# Altium project STM32_board_4layers.PrjPCB
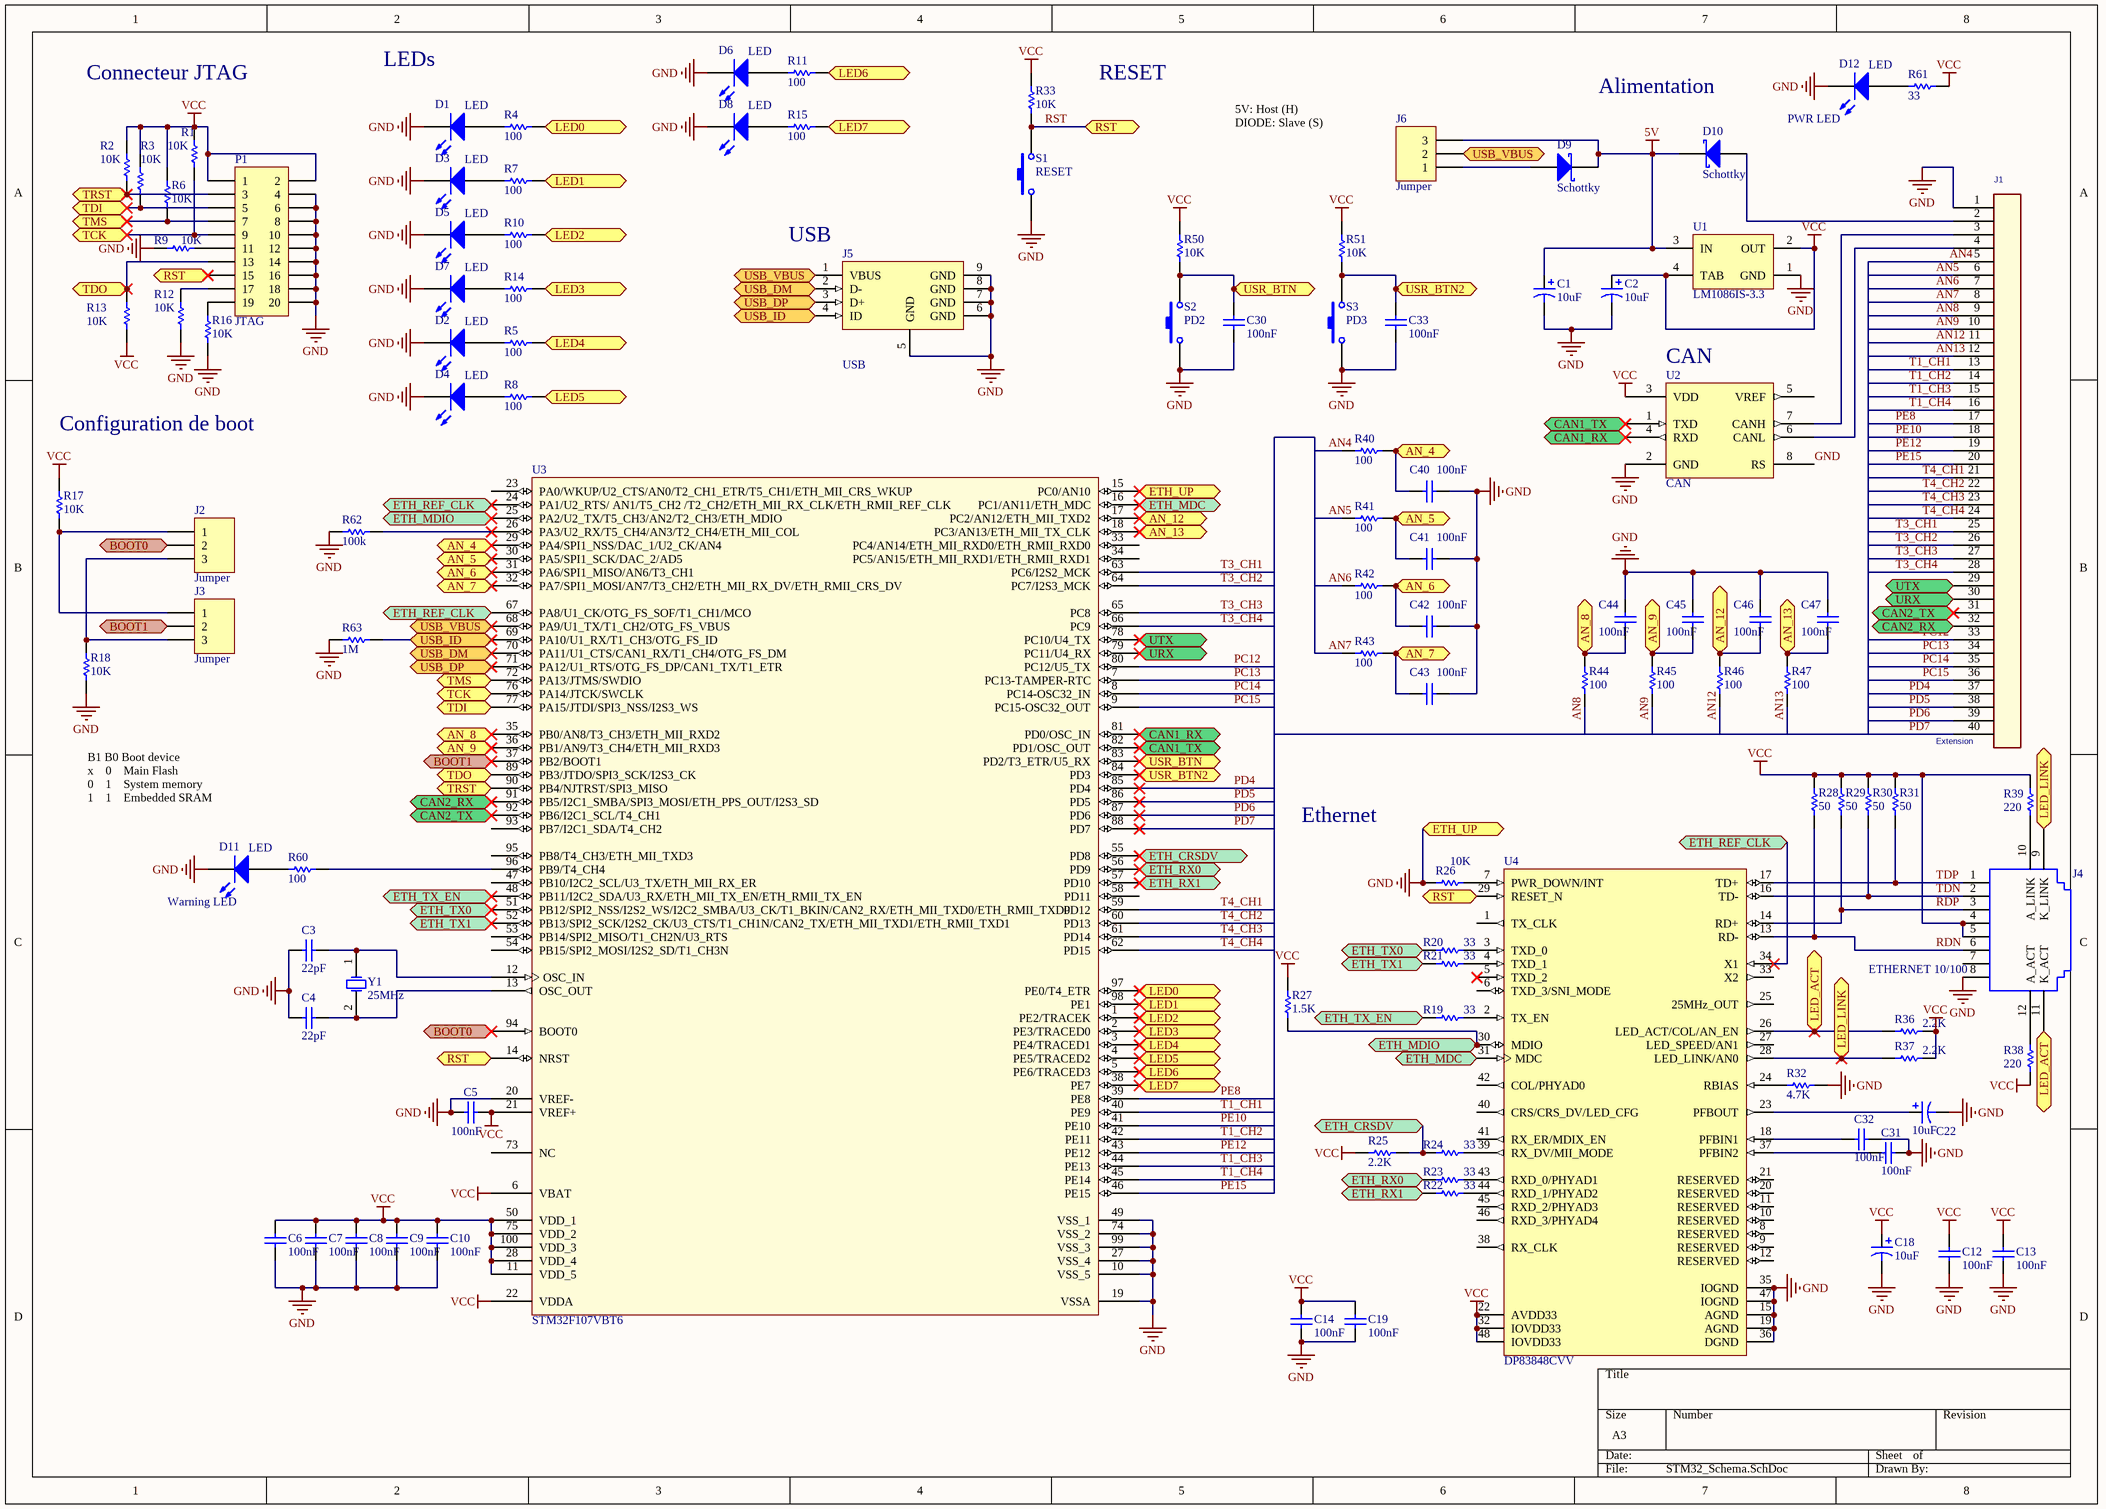
[diagram p0: STM32_Schema.SchDoc]
1 sheet, 106 parts. Net scope: flat (ports and power ports of the same name join across sheets).
Board file: STM32_PCB.PcbDoc

## Sheet STM32_Schema.SchDoc
size A3

### Parts
C1  10uF  [TC7343-2917]
C2  10uF  [TC7343-2917]
C3  22pF  [COND_CMS_0805]
C4  22pF  [COND_CMS_0805]
C5  100nF  [COND_CMS_0805]
C6  100nF  [COND_CMS_0805]
C7  100nF  [COND_CMS_0805]
C8  100nF  [COND_CMS_0805]
C9  100nF  [COND_CMS_0805]
C10  100nF  [COND_CMS_0805]
C12  100nF  [COND_CMS_0805]
C13  100nF  [COND_CMS_0805]
C14  100nF  [COND_CMS_0805]
C18  10uF  [TC7343-2917]
C19  100nF  [COND_CMS_0805]
C22  10uF  [TC7343-2917]
C30  100nF  [COND_CMS_0805]
C31  100nF  [COND_CMS_0805]
C32  100nF  [COND_CMS_0805]
C33  100nF  [COND_CMS_0805]
C40  100nF  [COND_CMS_0805]
C41  100nF  [COND_CMS_0805]
C42  100nF  [COND_CMS_0805]
C43  100nF  [COND_CMS_0805]
C44  100nF  [COND_CMS_0805]
C45  100nF  [COND_CMS_0805]
C46  100nF  [COND_CMS_0805]
C47  100nF  [COND_CMS_0805]
D1  LED  [LED_1206]
D2  LED  [LED_1206]
D3  LED  [LED_1206]
D4  LED  [LED_1206]
D5  LED  [LED_1206]
D6  LED  [LED_1206]
D7  LED  [LED_1206]
D8  LED  [LED_1206]
D9  Schottky  [DIODE_SMB]
D10  Schottky  [DIODE_SMB]
D11  LED  [LED_1206]
D12  LED  [LED_1206]
J1  Extension  [HE10/40_FACTO]
J2  Jumper  [HEADER3]
J3  Jumper  [HEADER3]
J4  ETHERNET 10/100  [RJ45_8/8 W/ LEDS]
J5  USB  [MINI_USB_B]
J6  Jumper  [HEADER3]
P1  JTAG  [HE10-JTAG-STM]
R1  10K  [RES_CMS_1206]
R2  10K  [RES_CMS_1206]
R3  10K  [RES_CMS_1206]
R4  100  [RES_CMS_1206]
R5  100  [RES_CMS_1206]
R6  10K  [RES_CMS_1206]
R7  100  [RES_CMS_1206]
R8  100  [RES_CMS_1206]
R9  10K  [RES_CMS_1206]
R10  100  [RES_CMS_1206]
R11  100  [RES_CMS_1206]
R12  10K  [RES_CMS_1206]
R13  10K  [RES_CMS_1206]
R14  100  [RES_CMS_1206]
R15  100  [RES_CMS_1206]
R16  10K  [RES_CMS_1206]
R17  10K  [RES_CMS_1206]
R18  10K  [RES_CMS_1206]
R19  33  [RES_CMS_1206]
R20  33  [RES_CMS_1206]
R21  33  [RES_CMS_1206]
R22  33  [RES_CMS_1206]
R23  33  [RES_CMS_1206]
R24  33  [RES_CMS_1206]
R25  2.2K  [RES_CMS_1206]
R26  10K  [RES_CMS_1206]
R27  1.5K  [RES_CMS_1206]
R28  50  [RES_CMS_1206]
R29  50  [RES_CMS_1206]
R30  50  [RES_CMS_1206]
R31  50  [RES_CMS_1206]
R32  4.7K  [RES_CMS_1206]
R33  10K  [RES_CMS_1206]
R36  2.2K  [RES_CMS_1206]
R37  2.2K  [RES_CMS_1206]
R38  220  [RES_CMS_1206]
R39  220  [RES_CMS_1206]
R40  100  [RES_CMS_1206]
R41  100  [RES_CMS_1206]
R42  100  [RES_CMS_1206]
R43  100  [RES_CMS_1206]
R44  100  [RES_CMS_1206]
R45  100  [RES_CMS_1206]
R46  100  [RES_CMS_1206]
R47  100  [RES_CMS_1206]
R50  10K  [RES_CMS_1206]
R51  10K  [RES_CMS_1206]
R60  100  [RES_CMS_1206]
R61  33  [RES_CMS_1206]
R62  100k  [RES_CMS_1206]
R63  1M  [RES_CMS_1206]
S1  RESET  [TOUCHE_KSA]
S2  PD2  [TOUCHE_KSA]
S3  PD3  [TOUCHE_KSA]
U1  LM1086IS-3.3  [TO-263]
U2  CAN  [SOIC8]
U3  STM32F107VBT6  [LQFP100_N]
U4  DP83848CVV  [LQFP48]
Y1  25MHz  [QUARTZ_CMS]

### Ports
AN_4, AN_5, AN_6, AN_7, AN_8, AN_9, AN_12, AN_13, BOOT0, BOOT1, CAN1_RX, CAN1_TX, CAN2_RX, CAN2_TX, ETH_CRSDV, ETH_MDC, ETH_MDIO, ETH_REF_CLK, ETH_RX0, ETH_RX1, ETH_TX0, ETH_TX1, ETH_TX_EN, ETH_UP, LED0, LED1, LED2, LED3, LED4, LED5, LED6, LED7, LED_ACT, LED_LINK, RST, TCK, TDI, TDO, TMS, TRST, URX, USB_DM, USB_DP, USB_ID, USB_VBUS, USR_BTN, USR_BTN2, UTX

### Nets
5V: C1.1 D9.1(K) D10.1(K) J6.3 U1.3(IN)
GND: C1.2 C2.2 C3.1 C4.1 C5.1 C6.1 C7.1 C8.1 C9.1 C10.1 C12.1 C13.1 C14.1 C18.2 C19.1 C22.2 C30.1 C31.1 C32.1 C33.1 C40.1 C41.1 C42.1 C43.1 C44.1 C45.1 C46.1 C47.1 D1.2 D2.2 D3.2 D4.2 D5.2 D6.2 D7.2 D8.2 D11.2 D12.2 J1.1 J4.8(GND) J5.5(GND) J5.6(GND) J5.7(GND) J5.8(GND) J5.9(GND) P1.4 P1.6 P1.8 P1.10 P1.12 P1.14 P1.16 P1.18 P1.20 R9.2 R12.1 R16.1 R18.2 R26.2 R32.1 R62.1 R63.1 S1.1 S2.1 S3.1 U1.1(GND) U2.2(GND) U2.8(RS) U3.10(VSS_5) U3.15(PC0/AN10) U3.19(VSSA) U3.20(VREF-) U3.27(VSS_4) U3.49(VSS_1) U3.74(VSS_2) U3.99(VSS_3) U4.15(AGND) U4.19(AGND) U4.35(IOGND) U4.36(DGND) U4.47(IOGND) ; port ETH_UP
VCC: C2.1 C5.2 C6.2 C7.2 C8.2 C9.2 C10.2 C12.2 C13.2 C14.2 C18.1 C19.2 J4.4(RD+) J4.5(RCT) P1.1 P1.2 R1.2 R2.2 R3.2 R6.2 R13.1 R17.1 R25.2 R27.2 R28.2 R29.2 R30.1 R31.2 R33.1 R36.1 R37.1 R38.2 R39.1 R50.1 R51.1 R61.2 U1.2(OUT) U1.4(TAB) U2.3(VDD) U3.6(VBAT) U3.11(VDD_5) U3.21(VREF+) U3.22(VDDA) U3.28(VDD_4) U3.50(VDD_1) U3.75(VDD_2) U3.100(VDD_3) U4.22(AVDD33) U4.32(IOVDD33) U4.48(IOVDD33)
AN4: J1.5 R40.1
AN5: J1.6 R41.1
AN6: J1.7 R42.1
AN7: J1.8 R43.1
AN8: J1.9 R44.1
AN9: J1.10 R45.1
AN12: J1.11 R46.1
AN13: J1.12 R47.1
PC12: J1.33 U3.80(PC12/U5_TX)
PC13: J1.34 U3.7(PC13-TAMPER-RTC)
PC14: J1.35 U3.8(PC14-OSC32_IN)
PC15: J1.36 U3.9(PC15-OSC32_OUT)
PD4: J1.37 U3.85(PD4)
PD5: J1.38 U3.86(PD5)
PD6: J1.39 U3.87(PD6)
PD7: J1.40 U3.88(PD7)
PE8: J1.17 U3.39(PE8)
PE10: J1.18 U3.41(PE10)
PE12: J1.19 U3.43(PE12)
PE15: J1.20 U3.46(PE15)
RDN: J4.6(RD-) R28.1 U4.13(RD-)
RDP: J4.3(TD-) R29.1 U4.14(RD+)
RST: P1.15 R33.2 S1.2 U3.14(NRST) U4.29(RESET_N) ; port RST
T1_CH1: J1.13 U3.40(PE9)
T1_CH2: J1.14 U3.42(PE11)
T1_CH3: J1.15 U3.44(PE13)
T1_CH4: J1.16 U3.45(PE14)
T3_CH1: J1.25 U3.63(PC6/I2S2_MCK)
T3_CH2: J1.26 U3.64(PC7/I2S3_MCK)
T3_CH3: J1.27 U3.65(PC8)
T3_CH4: J1.28 U3.66(PC9)
T4_CH1: J1.21 U3.59(PD12)
T4_CH2: J1.22 U3.60(PD13)
T4_CH3: J1.23 U3.61(PD14)
T4_CH4: J1.24 U3.62(PD15)
TDN: J4.2(TCT) R30.2 U4.16(TD-)
TDP: J4.1(TD+) R31.1 U4.17(TD+)
NetC3_2: C3.2 U3.12(OSC_IN) Y1.1(OSC1)
NetC4_2: C4.2 U3.13(OSC_OUT) Y1.2(OSC2)
NetC22_1: C22.1 U4.23(PFBOUT)
NetC30_2: C30.2 R50.2 S2.2 U3.83(PD2/T3_ETR/U5_RX) ; port USR_BTN
NetC31_2: C31.2 U4.37(PFBIN2)
NetC32_2: C32.2 U4.18(PFBIN1)
NetC33_2: C33.2 R51.2 S3.2 U3.84(PD3) ; port USR_BTN2
NetC40_2: C40.2 R40.2 U3.29(PA4/SPI1_NSS/DAC_1/U2_CK/AN4) ; port AN_4
NetC41_2: C41.2 R41.2 U3.30(PA5/SPI1_SCK/DAC_2/AD5) ; port AN_5
NetC42_2: C42.2 R42.2 U3.31(PA6/SPI1_MISO/AN6/T3_CH1) ; port AN_6
NetC43_2: C43.2 R43.2 U3.32(PA7/SPI1_MOSI/AN7/T3_CH2/ETH_MII_RX_DV/ETH_RMII_CRS_DV) ; port AN_7
NetC44_2: C44.2 R44.2 U3.35(PB0/AN8/T3_CH3/ETH_MII_RXD2) ; port AN_8
NetC45_2: C45.2 R45.2 U3.36(PB1/AN9/T3_CH4/ETH_MII_RXD3) ; port AN_9
NetC46_2: C46.2 R46.2 U3.17(PC2/AN12/ETH_MII_TXD2) ; port AN_12
NetC47_2: C47.2 R47.2 U3.18(PC3/AN13/ETH_MII_TX_CLK) ; port AN_13
NetD1_1: D1.1 R4.1
NetD2_1: D2.1 R5.1
NetD3_1: D3.1 R7.1
NetD4_1: D4.1 R8.1
NetD5_1: D5.1 R10.1
NetD6_1: D6.1 R11.1
NetD7_1: D7.1 R14.1
NetD8_1: D8.1 R15.1
NetD9_2: D9.2(A) J6.1
NetD10_2: D10.2(A) J1.2
NetD11_1: D11.1 R60.1
NetD12_1: D12.1 R61.1
NetJ1_3: J1.3 U2.7(CANH)
NetJ1_4: J1.4 U2.6(CANL)
NetJ1_29: J1.29 U3.78(PC10/U4_TX) ; port UTX
NetJ1_30: J1.30 U3.79(PC11/U4_RX) ; port URX
NetJ1_31: J1.31 U3.92(PB6/I2C1_SCL/T4_CH1) ; port CAN2_TX
NetJ1_32: J1.32 U3.91(PB5/I2C1_SMBA/SPI3_MOSI/ETH_PPS_OUT/I2S3_SD) ; port CAN2_RX
NetJ2_1: J2.1 J3.1 R17.2
NetJ2_2: J2.2 U3.94(BOOT0) ; port BOOT0
NetJ2_3: J2.3 J3.3 R18.1
NetJ3_2: J3.2 U3.37(PB2/BOOT1) ; port BOOT1
NetJ4_9: J4.9(K_LINK) R37.2 U4.28(LED_LINK/AN0) ; port LED_LINK
NetJ4_10: J4.10(A_LINK) R39.2
NetJ4_11: J4.11(K_ACT) R36.2 U4.26(LED_ACT/COL/AN_EN) ; port LED_ACT
NetJ4_12: J4.12(A_ACT) R38.1
NetJ5_1: J5.1(VBUS) J6.2 U3.68(PA9/U1_TX/T1_CH2/OTG_FS_VBUS) ; port USB_VBUS
NetJ5_2: J5.2(D-) U3.70(PA11/U1_CTS/CAN1_RX/T1_CH4/OTG_FS_DM) ; port USB_DM
NetJ5_3: J5.3(D+) U3.71(PA12/U1_RTS/OTG_FS_DP/CAN1_TX/T1_ETR) ; port USB_DP
NetJ5_4: J5.4(ID) R63.2 U3.69(PA10/U1_RX/T1_CH3/OTG_FS_ID) ; port USB_ID
NetP1_3: P1.3 R2.1 U3.90(PB4/NJTRST/SPI3_MISO) ; port TRST
NetP1_5: P1.5 R3.1 U3.77(PA15/JTDI/SPI3_NSS/I2S3_WS) ; port TDI
NetP1_7: P1.7 R6.1 U3.72(PA13/JTMS/SWDIO) ; port TMS
NetP1_9: P1.9 R1.1 U3.76(PA14/JTCK/SWCLK) ; port TCK
NetP1_11: P1.11 R9.1
NetP1_13: P1.13 R13.2 U3.89(PB3/JTDO/SPI3_SCK/I2S3_CK) ; port TDO
NetP1_17: P1.17 R12.2
NetP1_19: P1.19 R16.2
NetR4_2: R4.2 U3.97(PE0/T4_ETR) ; port LED0
NetR5_2: R5.2 U3.3(PE4/TRACED1) ; port LED4
NetR7_2: R7.2 U3.98(PE1) ; port LED1
NetR8_2: R8.2 U3.4(PE5/TRACED2) ; port LED5
NetR10_2: R10.2 U3.1(PE2/TRACEK) ; port LED2
NetR11_2: R11.2 U3.5(PE6/TRACED3) ; port LED6
NetR14_2: R14.2 U3.2(PE3/TRACED0) ; port LED3
NetR15_2: R15.2 U3.38(PE7) ; port LED7
NetR19_1: R19.1 U3.48(PB11/I2C2_SDA/U3_RX/ETH_MII_TX_EN/ETH_RMII_TX_EN) ; port ETH_TX_EN
NetR19_2: R19.2 U4.2(TX_EN)
NetR20_1: R20.1 U3.51(PB12/SPI2_NSS/I2S2_WS/I2C2_SMBA/U3_CK/T1_BKIN/CAN2_RX/ETH_MII_TXD0/ETH_RMII_TXD0) ; port ETH_TX0
NetR20_2: R20.2 U4.3(TXD_0)
NetR21_1: R21.1 U3.52(PB13/SPI2_SCK/I2S2_CK/U3_CTS/T1_CH1N/CAN2_TX/ETH_MII_TXD1/ETH_RMII_TXD1) ; port ETH_TX1
NetR21_2: R21.2 U4.4(TXD_1)
NetR22_1: R22.1 U3.57(PD10) ; port ETH_RX1
NetR22_2: R22.2 U4.44(RXD_1/PHYAD2)
NetR23_1: R23.1 U3.56(PD9) ; port ETH_RX0
NetR23_2: R23.2 U4.43(RXD_0/PHYAD1)
NetR24_1: R24.1 R25.1 U3.55(PD8) ; port ETH_CRSDV
NetR24_2: R24.2 U4.39(RX_DV/MII_MODE)
NetR26_1: R26.1 U4.7(PWR_DOWN/INT)
NetR27_1: R27.1 U3.25(PA2/U2_TX/T5_CH3/AN2/T2_CH3/ETH_MDIO) U4.30(MDIO) ; port ETH_MDIO
NetR32_2: R32.2 U4.24(RBIAS)
NetR60_2: R60.2 U3.96(PB9/T4_CH4)
NetR62_2: R62.2 U3.26(PA3/U2_RX/T5_CH4/AN3/T2_CH4/ETH_MII_COL)
NetU2_1: U2.1(TXD) U3.82(PD1/OSC_OUT) ; port CAN1_TX
NetU2_4: U2.4(RXD) U3.81(PD0/OSC_IN) ; port CAN1_RX
NetU3_16: U3.16(PC1/AN11/ETH_MDC) U4.31(MDC) ; port ETH_MDC
NetU3_24: U3.24(PA1/U2_RTS/_AN1/T5_CH2_/T2_CH2/ETH_MII_RX_CLK/ETH_RMII_REF_CLK) U3.67(PA8/U1_CK/OTG_FS_SOF/T1_CH1/MCO) U4.34(X1) ; port ETH_REF_CLK

Not connected (* = marked no-connect by the designer): J4 7; U2 5(VREF); U3 23(PA0/WKUP/U2_CTS/AN0/T2_CH1_ETR/T5_CH1/ETH_MII_CRS_WKUP) 33(PC4/AN14/ETH_MII_RXD0/ETH_RMII_RXD0) 34(PC5/AN15/ETH_MII_RXD1/ETH_RMII_RXD1) 47(PB10/I2C2_SCL/U3_TX/ETH_MII_RX_ER) 53(PB14/SPI2_MISO/T1_CH2N/U3_RTS) 54(PB15/SPI2_MOSI/I2S2_SD/T1_CH3N) 58(PD11) 73(NC) 93(PB7/I2C1_SDA/T4_CH2) 95(PB8/T4_CH3/ETH_MII_TXD3); U4 1(TX_CLK) 5(TXD_2)* 6(TXD_3/SNI_MODE) 8(RESERVED) 9(RESERVED) 10(RESERVED) 11(RESERVED) 12(RESERVED) 20(RESERVED) 21(RESERVED) 25(25MHz_OUT) 27(LED_SPEED/AN1) 33(X2) 38(RX_CLK) 40(CRS/CRS_DV/LED_CFG) 41(RX_ER/MDIX_EN) 42(COL/PHYAD0) 45(RXD_2/PHYAD3) 46(RXD_3/PHYAD4)

### Notes on the sheet
- Connecteur JTAG
- LEDs
- RESET
- Alimentation
- 5V: Host (H)
  DIODE: Slave (S)
- (near D12) PWR LED
- (near J5) USB
- (near U2) CAN
- Configuration de boot
- B1 B0 Boot device
  x    0    Main Flash
  0    1    System memory
  1    1    Embedded SRAM
- Ethernet
- (near D11) Warning LED

### Library data of the parts
C1 C2 C18 C22 = Cap Pol3: Polarized Capacitor (Surface Mount); Published: 8-Jun-2000; LatestRevisionDate: 17-Jul-2002; LatestRevisionNote: Re-released for DXP Platform.; PackageReference: C0805; Publisher: Altium Limited
C3 C4 = CONDENSATEUR: Capacitor; Published: 8-Jun-2000; LatestRevisionDate: 17-Jul-2002; LatestRevisionNote: Re-released for DXP Platform.; PackageReference: RAD-0.3; Publisher: Altium Limited
C5-C10 C12-C14 C19 C30-C33 C40-C47 = Cap Semi: Capacitor (Semiconductor SIM Model); Published: 8-Jun-2000; LatestRevisionDate: 17-Jul-2002; LatestRevisionNote: Re-released for DXP Platform.; PackageReference: C1206; Publisher: Altium Limited
D1-D8 D11 D12 = LED: Typical RED, GREEN, YELLOW, AMBER GaAs LED; pin to pad: 1>A 2>C; Published: 8-Jun-2000; LatestRevisionDate: 17-Jul-2002; LatestRevisionNote: Re-released for DXP Platform.; PackageDocument: Feb-2002; PackageReference: 3.2X1.6X1.1; Publisher: Altium Limited
D9 D10 = DIODE_SCHOTTKY_SMB: Schottky Diode; Published: 8-Jun-2000; LatestRevisionDate: 17-Jul-2002; LatestRevisionNote: Re-released for DXP Platform.; PackageReference: SMB; Publisher: Altium Limited; Code_JEDEC: DO-214-AA
J1 = CONNECTEUR_HE10_40
J2 J3 J6 = BARRETTE3: Header, 3-Pin; LatestRevisionDate: 17-Jul-2002; LatestRevisionNote: Re-released for DXP Platform.; Publisher: Altium Limited
J4 = Ethernet: 2-406549-1 (Tyco); Ports: 1; Positions/Loaded: Port1 - 8 Keyed/8; PerformanceCategory: 3; PCB_Mounting: Thru-Hole; ComponentAvailability: Obsolete; DrillSize: Nominal, Rounded to nearest 0.05mm; PCB_Layout: Complies with Manufacturer's Recommendation.; Published: 25-Jun-2002; DatasheetDocument: 18-Dec-2001; PackageDocument: 18-Dec-2001; PackageReference: 15-43-6233; Publisher: Altium Limited; ComponentLink1Description: Manufacturer Link; ComponentLink1URL: http://www.molex.com/; ComponentLink2Description: Datasheet; ComponentLink2URL: http://www.molex.com/cmc_upload/common_files/1212003_catalogmx41314.pdf; ComponentLink3Description: Iges Model; ComponentLink3URL: http://www.molex.com/pdm_docs/igs/15-43-6233_igs.zip
J5 = USB_Mini: USB 1.1, Right Angle, SMT, A Type, Receptacle, 4 Position, White; ContactMaterial: Copper Alloy; ContactPlating: Gold over Palladium Nickel; PCB_Layout: Complies with manufacturer's recommendation.; DrillSize: Corresponds to nominal value.; PanelGround: Without; Published: 15-Jul-2004; DatasheetDocument: 11-Apr-2003; PackageDocument: 11-Apr-2003; PackageReference: 353576; Publisher: Altium Limited; HousingMaterial: Thermoplastic; ComponentLink1Description: Manufacturer Link; ComponentLink1URL: http://www.tycoelectronics.com/; ComponentLink2Description: Packaging Specification; ComponentLink2URL: http://ecommas.tycoelectronics.com/commerce/DocumentDelivery/DDEController?Action=showdoc&DocId=Customer+Drawing%7F353576%7FD%7Ftif%7FJapanese%7FJPN_CD_353576_D.tif
P1 = Header 10X2: Header, 10-Pin, Dual row; LatestRevisionDate: 17-Jul-2002; LatestRevisionNote: Re-released for DXP Platform.; Publisher: Altium Limited
R1-R3 R6 R9 R12 R13 R16-R18 R33 R40-R47 R50 R51 = Res Semi: Semiconductor Resistor; Published: 8-Jun-2000; LatestRevisionDate: 17-Jul-2002; LatestRevisionNote: Re-released for DXP Platform.; PackageReference: AXIAL-0.5; Publisher: Altium Limited
R4 R5 R7 R8 R10 R11 R14 R15 R19-R32 R36-R39 R60-R63 = RESISTANCE: Resistor; Published: 8-Jun-2000; LatestRevisionDate: 17-Jul-2002; LatestRevisionNote: Re-released for DXP Platform.; PackageReference: AXIAL-0.3; Publisher: Altium Limited
S1-S3 = BOUTON POUSSOIR: Switch; Published: 24-Mar-1999; LatestRevisionDate: 17-Jul-2002; LatestRevisionNote: Re-released for DXP Platform.; PackageReference: SPST-2; Publisher: Altium Limited
U1 = LM1086IS-3.3: VCC; Manufacturer: National Semiconductor; CompType: LDO IC; PackageTopMarking: NSUZXYTTE#*LM1086*IS-3.3; Published: 27-Nov-2008; DatasheetVersion: Jun-2005; PackageVersion: revF, Apr-2005; PackageReference: TS3B; Publisher: Altium Limited; PackageDescription: TO-263, Molded, .400 x .390 x .180in, 3 Lead, .1in Pitch, Surface Mount; PartNumber: LM1086IS-3.3; RoHS: O; PinCount: 3; DigiKeyPartNumber: LM1086IS-3.3-ND; Code_JEDEC: MO-169-AA; ComponentLink1Description: LM1086 Datasheet; ComponentLink1URL: http://www.national.com/ds/LM/LM1086.pdf; ComponentLink2Description: LM1086 Web Page; ComponentLink2URL: http://www.national.com/pf/LM/LM1086.html; ComponentLink3Description: TS3B Package Page; ComponentLink3URL: http://www.national.com/packaging/folders/ts3b.html
U2 = MCP2551: High Speed Can Transceiver; Published: 6-Oct-2005; LatestRevisionDate: 13-Apr-2006; LatestRevisionNote: IPC-7351 Footprint Added.; DatasheetVersion: Nov-2003; PackageVersion: Oct-2005; PackageReference: SOIC150-8; Publisher: Altium Limited; PackageDescription: 8-Pin Plastic Narrow Body Small Outline Integrated Circuit 1.27 mm Pitch; Code_JEDEC: MS-012; ComponentLink1Description: Manufacturer Link; ComponentLink1URL: http://www.microchip.com; ComponentLink2Description: Datasheet; ComponentLink2URL: http://ww1.microchip.com/downloads/en/DeviceDoc/21667d.pdf
U3 = STM32F103VBT6: STM32 ARM-based 32-bit MCU with 64 Kbytes Flash, 100-pin LQFP, Industrial Temperature; Published: 30-May-2008; DatasheetVersion: rev6, Mar-2008; PackageVersion: Mar-2008; PackageReference: LQFP100; Publisher: Altium Limited; PackageDescription: 100-Pin Low-Profile Quad Flat Pack, 14 x 14 mm Body, 0.5 mm Pitch (LQFP100); ComponentLink1Description: Manufacturer Link; ComponentLink1URL: www.st.com/stm32; ComponentLink2Description: Datasheet; ComponentLink2URL: http://www.st.com/stonline/products/literature/ds/13587.pdf
U4 = DP83848CVV: PHYTER® Commercial Temperature Single Port 10/100 Mb/s Ethernet Physical Layer Transceiver; Manufacturer: National Semiconductor; CompType: Interface IC; PackageTopMarking: NSUZXYTT*DP83848VV*VBC; Published: 27-Nov-2008; DatasheetVersion: Feb-2007; PackageVersion: revE, May-2007; PackageReference: VBH48A; Publisher: Altium Limited; PackageDescription: LQFP, 7 x 7 x 1.4mm, 48 Lead, 0.5mm Pitch; PartNumber: DP83848CVV; RoHS: Y; PinCount: 48; DigiKeyPartNumber: DP83848CVV-ND; ComponentLink1Description: DP83848C Datasheet; ComponentLink1URL: http://www.national.com/ds/DP/DP83848C.pdf; ComponentLink2Description: DP83848C Web Page; ComponentLink2URL: http://www.national.com/pf/DP/DP83848C.html; ComponentLink3Description: VBH48A Package Page; ComponentLink3URL: http://www.national.com/packaging/folders/vbh48a.html
Y1 = QUARTZ: Crystal Oscillator; Published: 8-Jun-2000; LatestRevisionDate: 17-Jul-2002; LatestRevisionNote: Re-released for DXP Platform.; PackageReference: R38; Publisher: Altium Limited